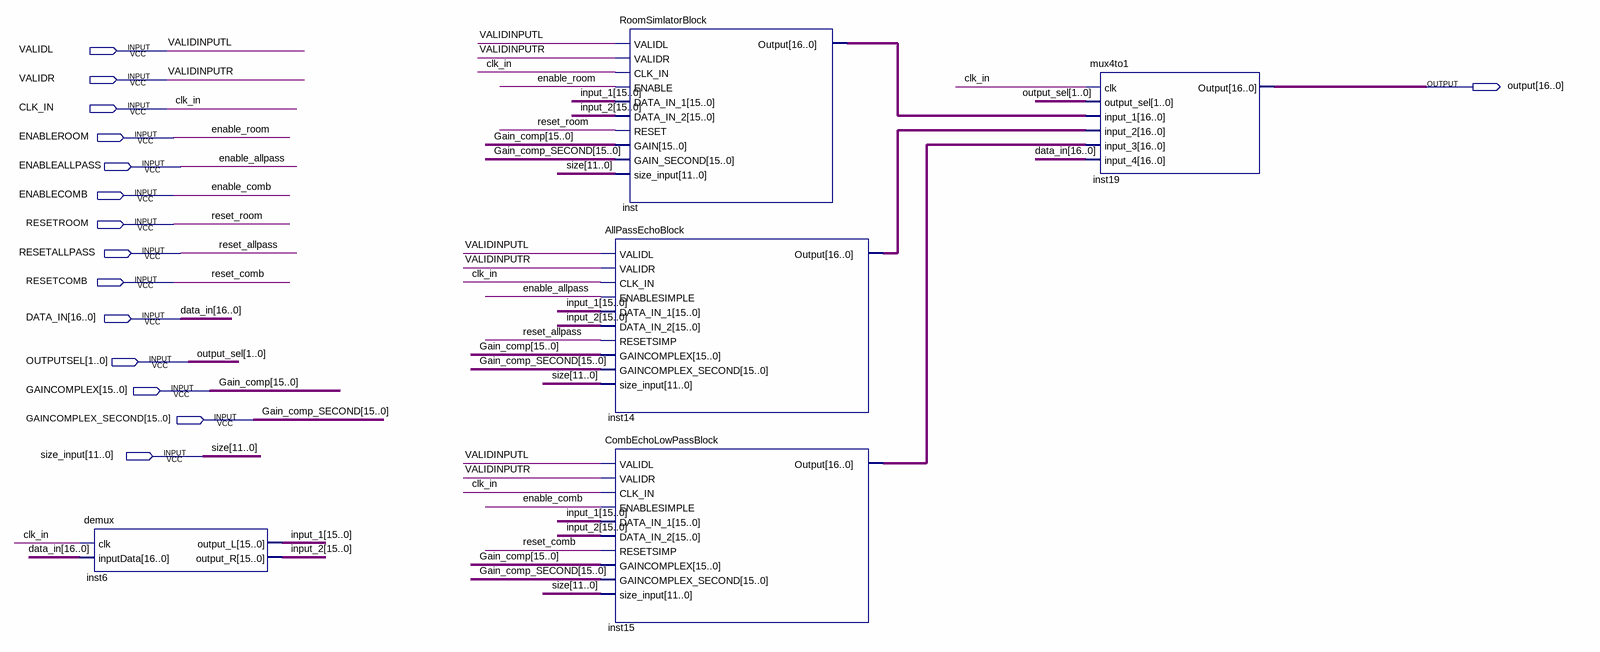
[diagram p0: schematic sheet]
// Quartus schematic ASP.bdf as structural Verilog: 5 symbols, 15 pins
module ASP (
  input  VALIDL,
  input  VALIDR,
  input  CLK_IN,
  input  ENABLEROOM,
  input  ENABLEALLPASS,
  input  ENABLECOMB,
  input  RESETROOM,
  input  RESETALLPASS,
  input  RESETCOMB,
  input  [16:0] DATA_IN,
  input  [1:0] OUTPUTSEL,
  input  [15:0] GAINCOMPLEX,
  input  [15:0] GAINCOMPLEX_SECOND,
  input  [11:0] size_input,
  output [16:0] \output 
);

  wire [15:0] input_1, input_2;
  wire [16:0] inst14_output, inst15_output, inst_output;

  demux inst6 (.clk(CLK_IN), .inputData(DATA_IN), .output_L(input_1), .output_R(input_2));
  RoomSimlatorBlock inst (
    .VALIDL(VALIDL), .VALIDR(VALIDR), .CLK_IN(CLK_IN), .ENABLE(ENABLEROOM), .DATA_IN_1(input_1),
    .DATA_IN_2(input_2), .RESET(RESETROOM), .GAIN(GAINCOMPLEX), .GAIN_SECOND(GAINCOMPLEX_SECOND),
    .size_input(size_input), .Output(inst_output));
  AllPassEchoBlock inst14 (
    .VALIDL(VALIDL), .VALIDR(VALIDR), .CLK_IN(CLK_IN), .ENABLESIMPLE(ENABLEALLPASS), .DATA_IN_1(input_1),
    .DATA_IN_2(input_2), .RESETSIMP(RESETALLPASS), .GAINCOMPLEX(GAINCOMPLEX),
    .GAINCOMPLEX_SECOND(GAINCOMPLEX_SECOND), .size_input(size_input), .Output(inst14_output));
  CombEchoLowPassBlock inst15 (
    .VALIDL(VALIDL), .VALIDR(VALIDR), .CLK_IN(CLK_IN), .ENABLESIMPLE(ENABLECOMB), .DATA_IN_1(input_1),
    .DATA_IN_2(input_2), .RESETSIMP(RESETCOMB), .GAINCOMPLEX(GAINCOMPLEX),
    .GAINCOMPLEX_SECOND(GAINCOMPLEX_SECOND), .size_input(size_input), .Output(inst15_output));
  mux4to1 inst19 (
    .clk(CLK_IN), .output_sel(OUTPUTSEL), .input_1(inst_output), .input_2(inst14_output),
    .input_3(inst15_output), .input_4(DATA_IN), .Output(\output ));

  // Other names for the same wires on the sheet: enable_allpass = ENABLEALLPASS; enable_comb = ENABLECOMB;
  //   enable_room = ENABLEROOM; Gain_comp[15:0] = GAINCOMPLEX; Gain_comp_SECOND[15:0] = GAINCOMPLEX_SECOND;
  //   output_sel[1:0] = OUTPUTSEL; reset_allpass = RESETALLPASS; reset_comb = RESETCOMB; reset_room = RESETROOM;
  //   size[11:0] = size_input; VALIDINPUTL = VALIDL; VALIDINPUTR = VALIDR
endmodule
